# EAGLE schematic Main-DESKTOP-GF130J3 (EAGLE 9.4.2)

## Sheet 1 of 4: Filter EMI PMP20694
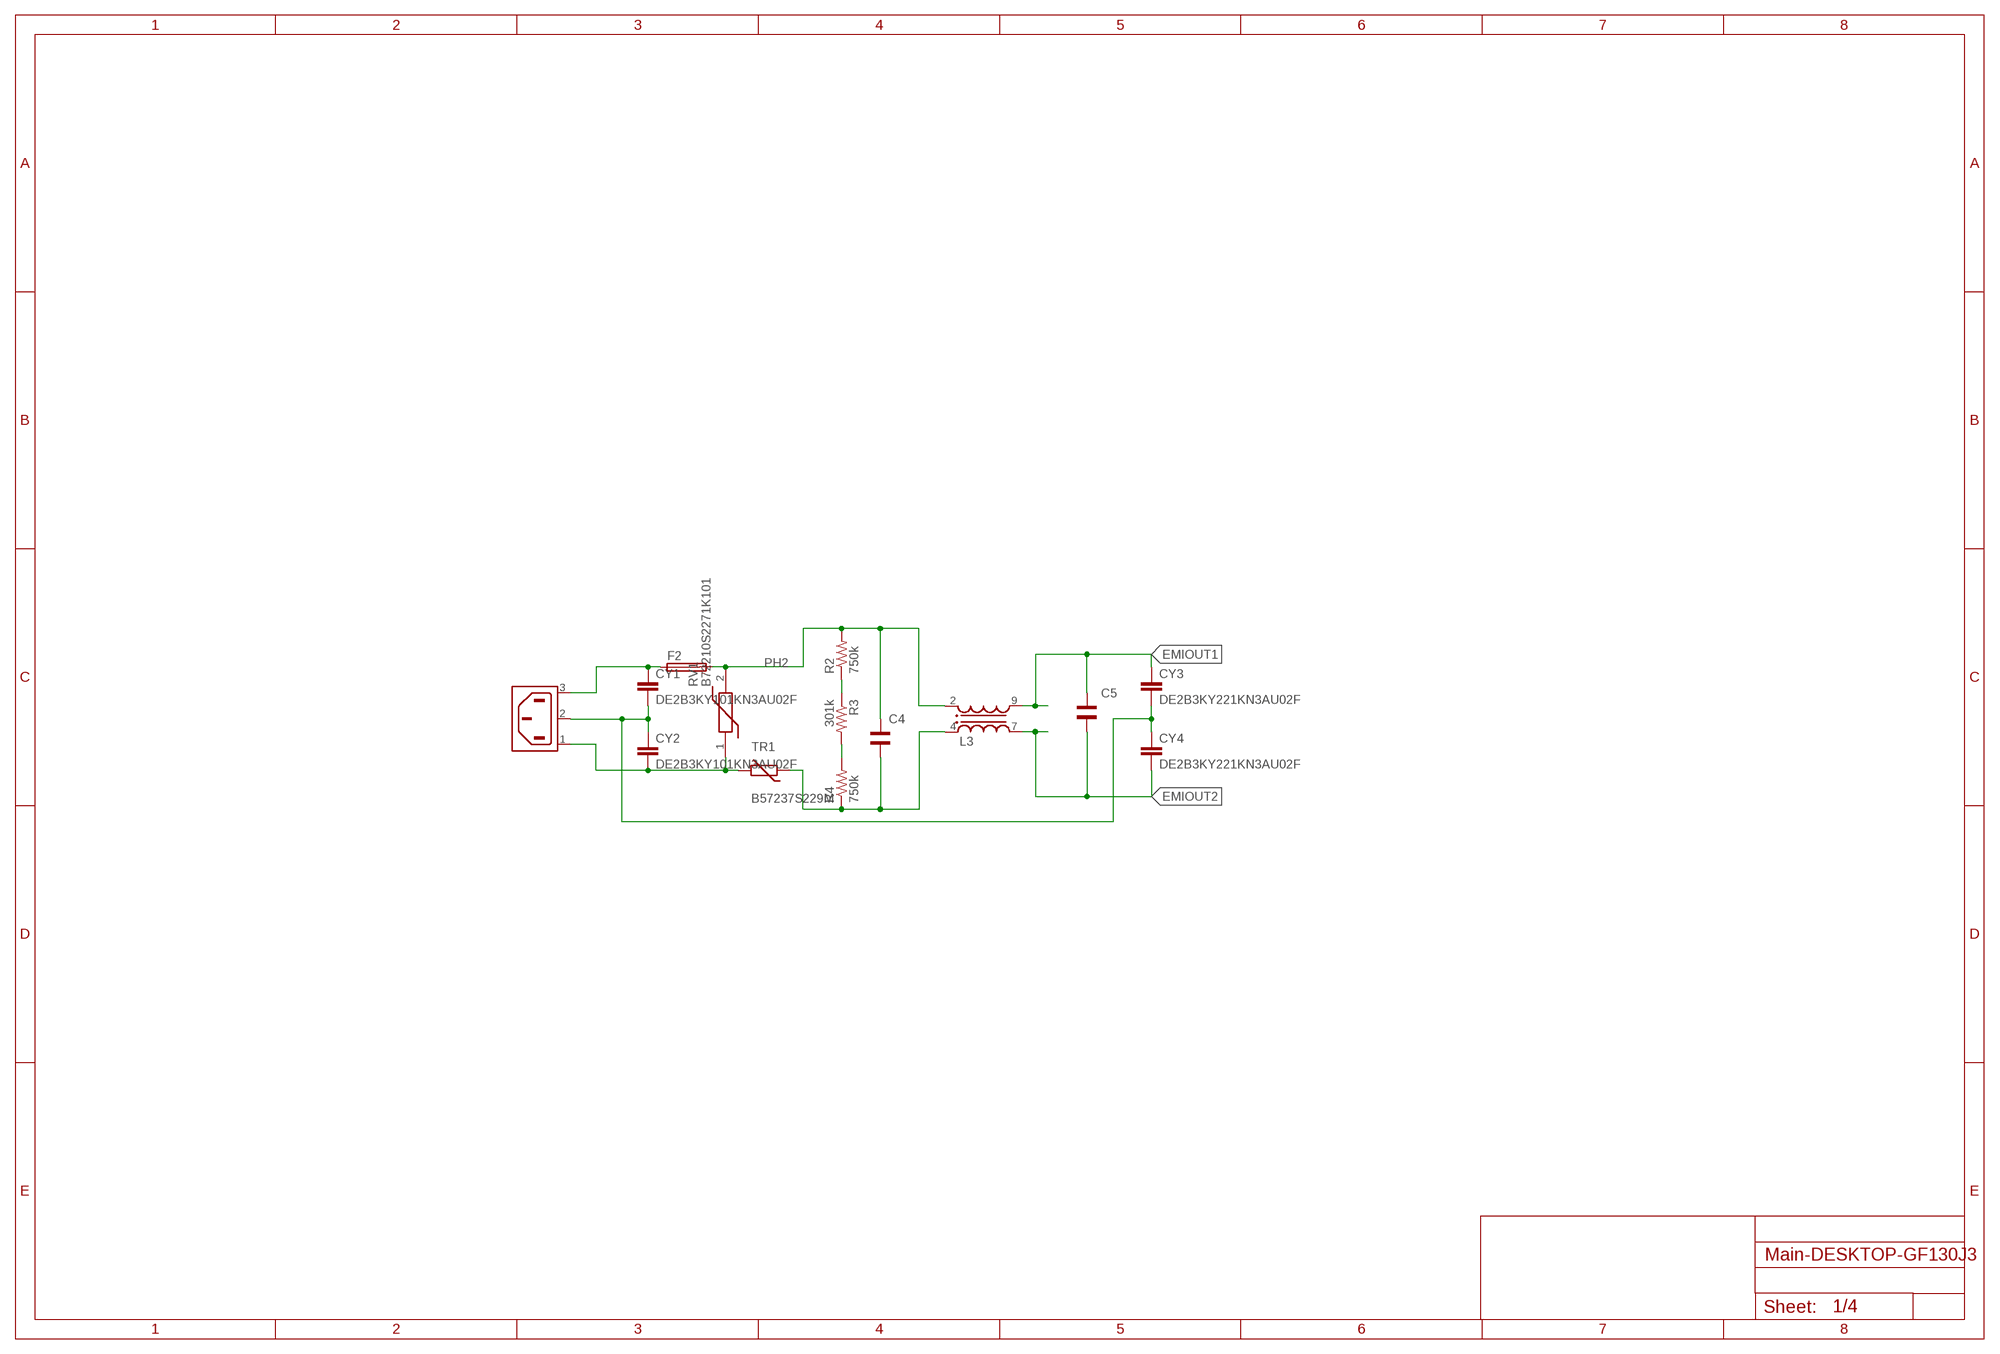
[diagram p0: schematic, sheet 1]

### Parts
C4  WCAP-FTXX_890334025039CS  [WCAP-FTXX_15X18X14X8]
C5  WCAP-FTXX_890334025039CS  [WCAP-FTXX_15X18X14X8]
CY1  DE2B3KY101KN3AU02F  CYYC7B5  [YC7B5]
CY2  DE2B3KY101KN3AU02F  CYYC7B5  [YC7B5]
CY3  DE2B3KY221KN3AU02F  CYYC7B5  [YC7B5]
CY4  DE2B3KY221KN3AU02F  CYYC7B5  [YC7B5]
F2  GSH15  [GSH15]
L3  WE-CMB_L_744824310  [WE-CMB_L]
R2  750k  R-US_R1206  [R1206]
R3  301k  R-US_R1206  [R1206]
R4  750k  R-US_R1206  [R1206]
RV1  B72210S2271K101  [B72210S2271K101]
TR1  B57237S229M  THERMISTOR_R-7,5  [R-7,5]
X1  6ESRM-P  [6ESRM-P]

### Nets
EMIOUT1: C5.2 CY3.1 L3.9 ; also sheet 2
EMIOUT2: C5.1 CY4.2 L3.7 ; also sheet 2
N$20: R2.1 R3.1
N$25: R3.2 R4.2
N$29: CY1.1 F2.1 X1.3(AC2)
N$38: CY2.2 RV1.1 TR1.2 X1.1(AC1)
N$40: C4.2 L3.4 R4.1 TR1.1
N$45: CY1.2 CY2.1 CY3.2 CY4.1 X1.2(SH)
PH2: C4.1 F2.2 L3.2 R2.2 RV1.2

## Sheet 2 of 4: PFC
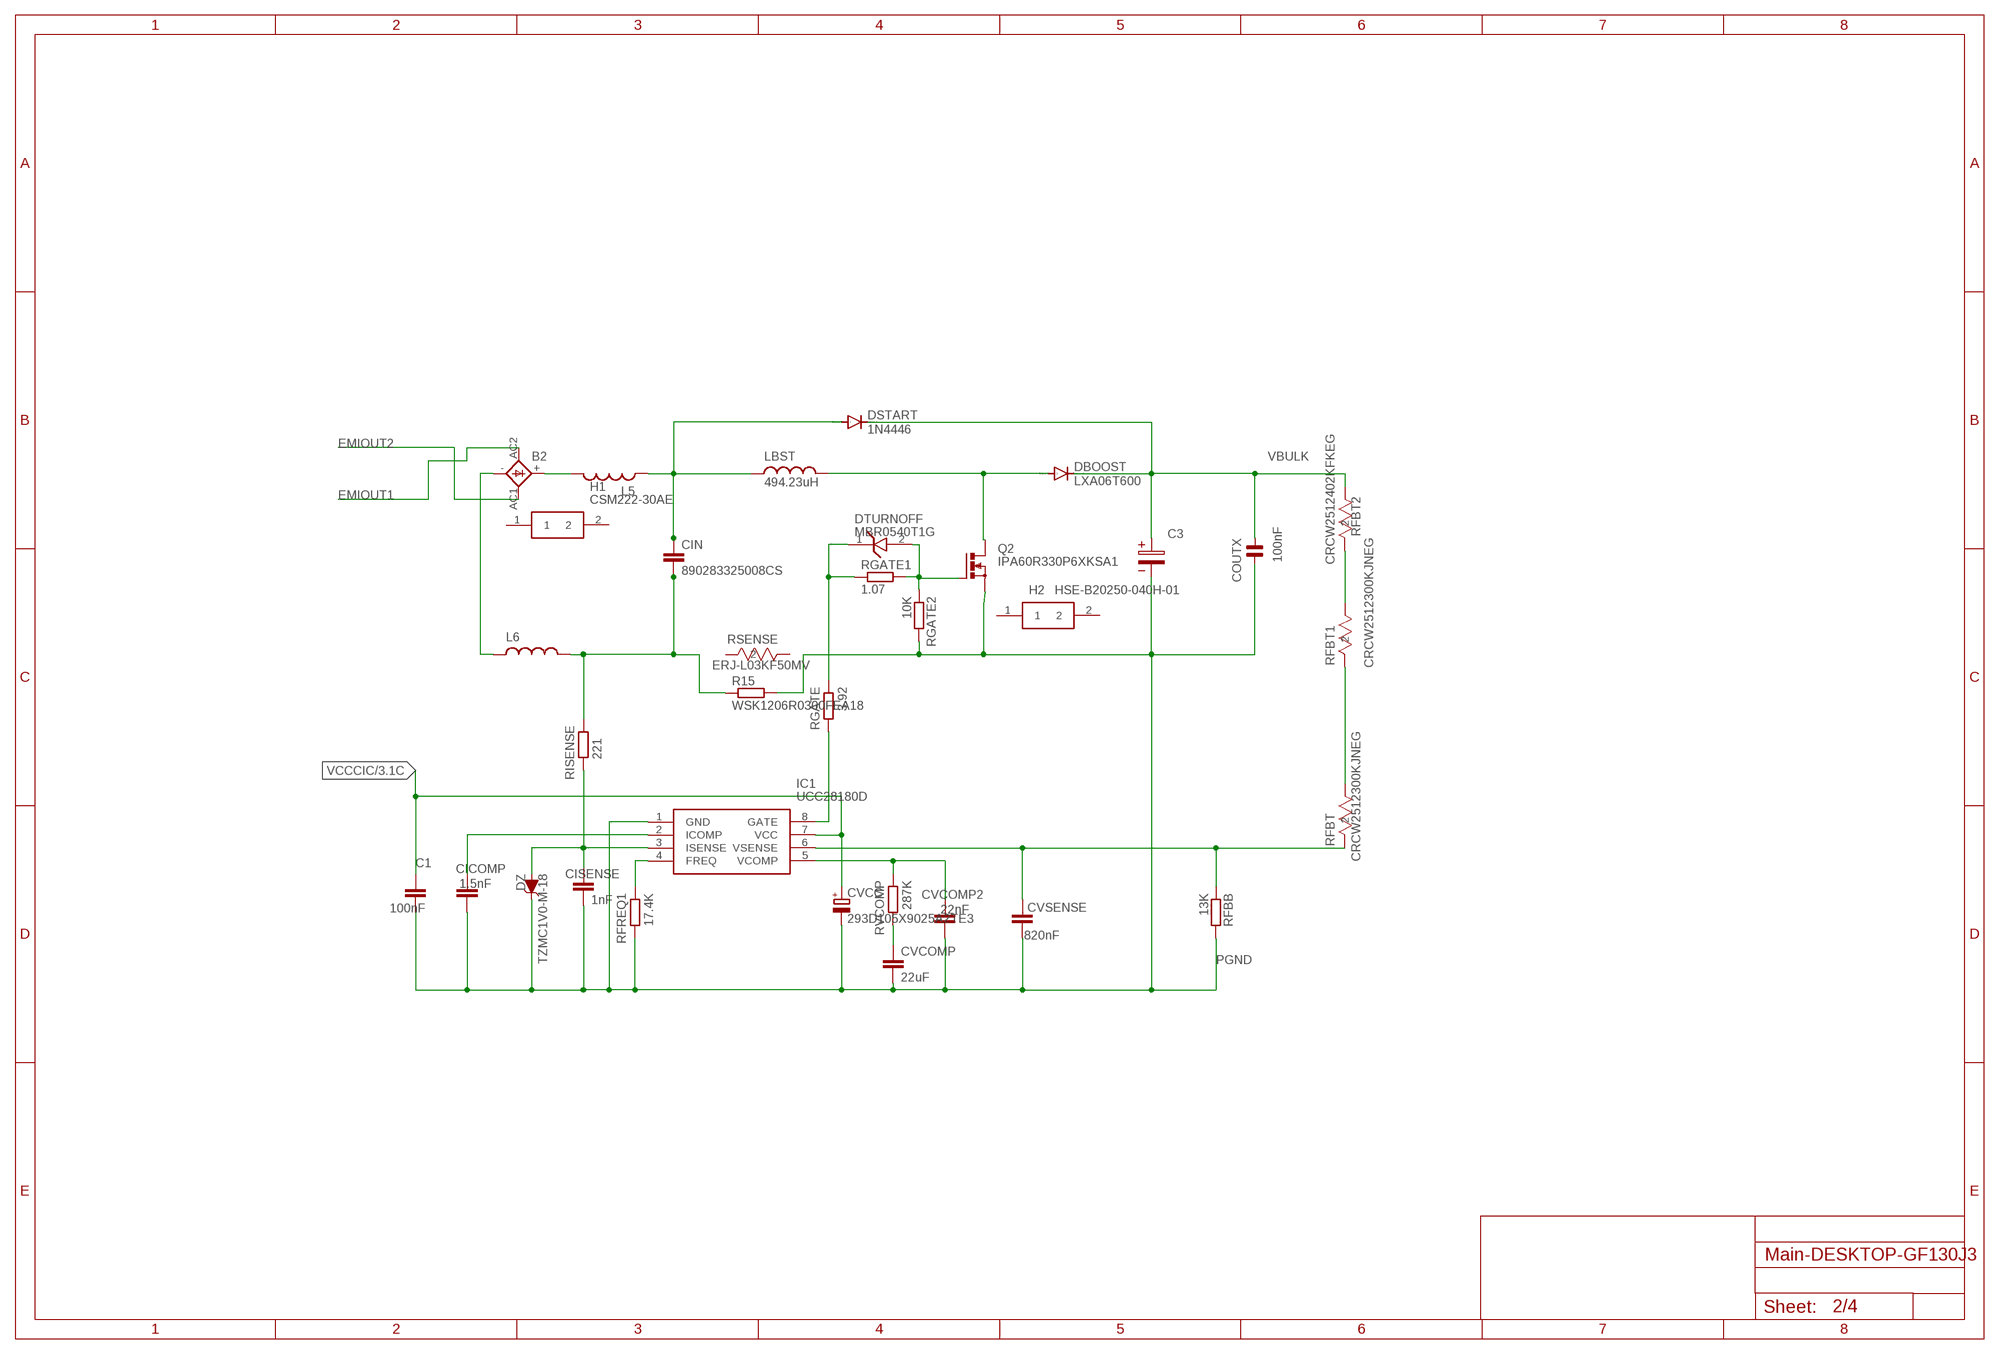
[diagram p1: schematic, sheet 2]

### Parts
B2  GBU4  [GBU4S]
C1  100nF  C-EUC0603  [C0603]
C3  WCAP-AIG8_30X46_861011485018  [30X10X2(DXPXΦ)]
CICOMP  1.5nF  C-EUC0603K  [C0603K]
CIN  890283325008CS  C-EU150-072X183  [C150-072X183]
CISENSE  1nF  C-EUC0402  [C0402]
COUTX  100nF  C-NP-10,0-14,0X6,0  [C10,0-14,0X6,0]
CVCC  293D105X9025A2TE3  CPOL-EUCT3216  [CT3216]
CVCOMP  22uF  C-EUC0805  [C0805]
CVCOMP2  22nF  C-EUC0603K  [C0603K]
CVSENSE  820nF  C-EUC0805  [C0805]
DBOOST  LXA06T600  DIODE-TO220V  [TO220ACS]
DSTART  1N4446  [DO35-10]
DTURNOFF  MBR0540T1G  [SOD3716X135N]
DZ  TZMC1V0-M-18  [DIOMELF3515]
H1  CSM222-30AE  [CSM22230AE]
H2  HSE-B20250-040H-01  [HSEB20250040H01]
IC1  UCC28180D  [SOIC127P600X175-8N]
L5  WE-FI_7447016  [WE-FI_7447016]
L6  WE-FI_7447016  [WE-FI_7447016]
LBST  494.23uH  WE-SI_744139  [WE-SI_744139]
Q2  IPA60R330P6XKSA1  PMOSFET_NTO220BV  [TO220BV]
R15  WSK1206R0300FEA18  R-EU_R3216  [R3216]
RFBB  13K  R-EU_R0603  [R0603]
RFBT  CRCW2512300KJNEG  [RC2512N]
RFBT1  CRCW2512300KJNEG  [RC2512N]
RFBT2  CRCW2512402KFKEG  [RC2512N]
RFREQ1  17.4K  R-EU_R0603  [R0603]
RGATE  3.92  R-EU_R0603  [R0603]
RGATE1  1.07  R-EU_R0603  [R0603]
RGATE2  10K  R-EU_R0603  [R0603]
RISENSE  221  R-EU_R0603  [R0603]
RSENSE  ERJ-L03KF50MV  [RC0603N]
RVCOMP  287K  R-EU_R0603  [R0603]

### Nets
EMIOUT1: B2.AC2(AC1) ; also sheet 1
EMIOUT2: B2.AC1(AC2) ; also sheet 1
GATE: IC1.8(GATE) RGATE.2
N$1: B2.- L6.1
N$2: CIN.2 L6.2 R15.1 RISENSE.1
N$3: DBOOST.A LBST.2 Q2.D
N$4: B2.+ L5.2
N$7: CIN.1 DSTART.A L5.1 LBST.1
N$10: DTURNOFF.2(A) Q2.G RGATE1.2 RGATE2.1
N$11: DTURNOFF.1(K) RGATE1.1 RGATE.1
N$16: CVCOMP.1 RVCOMP.2
N$28: RFBT1.1 RFBT2.2
N$31: RFBT1.2 RFBT.1
N$FREQ: IC1.4(FREQ) RFREQ1.1
N$ICOMP: CICOMP.2 IC1.2(ICOMP)
N$ISENSE: CISENSE.1 DZ.1(A) IC1.3(ISENSE) RISENSE.2
N$VCOMP: CVCOMP2.2 IC1.5(VCOMP) RVCOMP.1
N$VSENSE: CVSENSE.2 IC1.6(VSENSE) RFBB.1 RFBT.2
PGND: C1.2 C3.2 CICOMP.1 CISENSE.2 COUTX.2 CVCC.- CVCOMP2.1 CVCOMP.2 CVSENSE.1 DZ.2(C) IC1.1(GND) Q2.S R15.2 RFBB.2 RFREQ1.2 RGATE2.2 ; also sheet 3
VBULK: C3.1 COUTX.1 DBOOST.C DSTART.C RFBT2.1 ; also sheet 3
VCCCIC: C1.1 CVCC.+ IC1.7(VCC) ; also sheet 3
Unconnected: H1.1 H1.2 H2.1 H2.2 RSENSE.1 RSENSE.2

## Sheet 3 of 4: Flyback
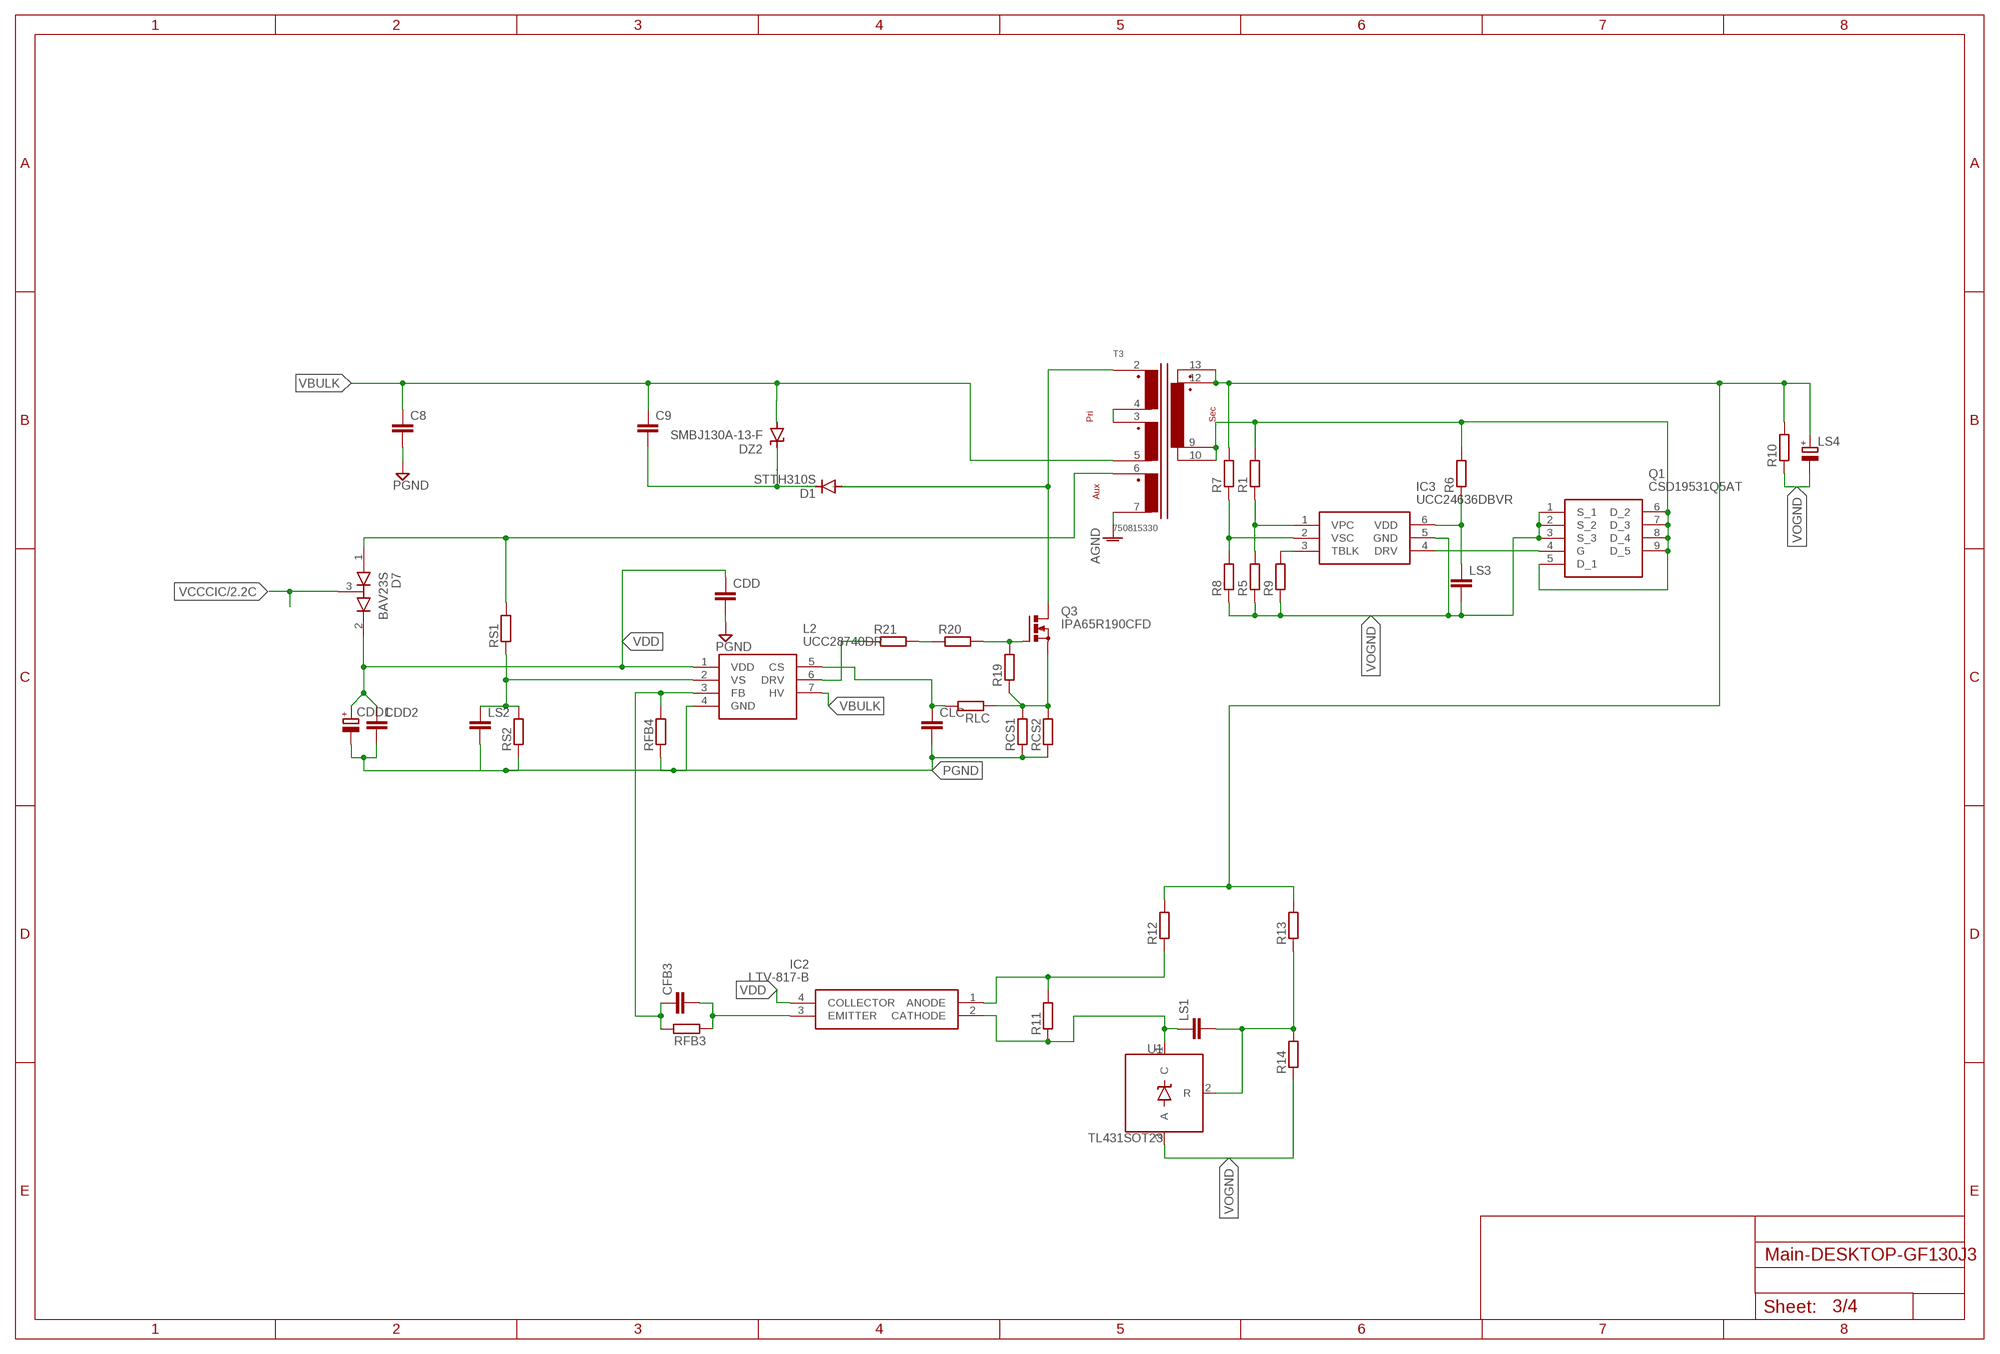
[diagram p2: schematic, sheet 3]

### Parts
C8  C-EUC0805  [C0805]
C9  C-EUC0805  [C0805]
CDD  C-EUC0805  [C0805]
CDD1  CPOL-EUTT2D5  [TT2D5]
CDD2  C-EUC0805  [C0805]
CFB3  C-EUC0805  [C0805]
CLC  C-EUC0805  [C0805]
D1  STTH310S  DIODE-SMC  [SMC]
D7  BAV23S  [SOT95P230X110-3N]
DZ2  SMBJ130A-13-F  SUPPRESSOR-SMBJ  [SMBJ]
IC2  LTV-817-B  [DIP762W60P254L460H420Q4N]
IC3  UCC24636DBVR  [SOT95P280X145-6N]
L2  UCC28740DR  [D(R-PDSO-G7)]
LS1  C-EUC0805  [C0805]
LS2  C-EUC0805  [C0805]
LS3  C-EUC0805  [C0805]
LS4  CPOL-EU153CLV-1010  [153CLV-1010]
Q1  CSD19531Q5AT  [CSD19531Q5AT]
Q3  IPA65R190CFD  PMOSFET_NTO220BV  [TO220BV]
R1  R-EU_R0805  [R0805]
R5  R-EU_R0805  [R0805]
R6  R-EU_R0805  [R0805]
R7  R-EU_R0805  [R0805]
R8  R-EU_R0805  [R0805]
R9  R-EU_R0805  [R0805]
R10  R-EU_R0805  [R0805]
R11  R-EU_R0805  [R0805]
R12  R-EU_R0805  [R0805]
R13  R-EU_R0805  [R0805]
R14  R-EU_R0805  [R0805]
R19  R-EU_R0805  [R0805]
R20  R-EU_R0805  [R0805]
R21  R-EU_R0805  [R0805]
RCS1  R-EU_R0805  [R0805]
RCS2  R-EU_R0805  [R0805]
RFB3  R-EU_R0805  [R0805]
RFB4  R-EU_R0805  [R0805]
RLC  R-EU_R0805  [R0805]
RS1  R-EU_R0805  [R0805]
RS2  R-EU_R0805  [R0805]
T3  750815330  [EE25/13/7_THT_H_14PIN_(5644)]
U1  TL431SOT23  [SOT23-3]

### Nets
N$5: LS1.2 R13.1 R14.2 U1.2(R)
N$6: CFB3.2 IC2.3(EMITTER) RFB3.1
N$8: T3.3 T3.4
N$12: D7.1 RS1.2 T3.6
N$15: IC2.1(ANODE) R11.2 R12.1
N$17: CFB3.1 L2.3(FB) RFB3.2 RFB4.2
N$18: IC2.2(CATHODE) LS1.1 R11.1 U1.1(C)
N$19: LS4.+ R7.2 R10.2 R12.2 R13.2 T3.12 T3.13
N$21: IC3.2(VSC) R7.1 R8.2
N$22: IC3.4(DRV) Q1.4(G)
N$23: IC3.1(VPC) R1.1 R5.2
N$24: IC3.3(TBLK) R9.2
N$26: IC3.6(VDD) LS3.1 R6.1
N$27: L2.2(VS) LS2.1 RS1.1 RS2.2
N$30: Q1.5(D_1) Q1.6(D_2) Q1.7(D_3) Q1.8(D_4) Q1.9(D_5) R1.2 R6.2 T3.9 T3.10
N$43: R20.1 R21.2
N$44: Q3.G R19.2 R20.2
N$50: C9.2 D1.C DZ2.C
N$52: D1.A Q3.D T3.2
N$CS: CLC.1 L2.5(CS) RLC.2
N$DRV: L2.6(DRV) R21.1
PGND: C8.2 CDD1.- CDD2.2 CDD.2 CLC.2 L2.4(GND) LS2.2 RCS1.1 RCS2.1 RFB4.1 RS2.1 T3.7 ; supply symbol labelled AGND ; also sheet 2
TOISENSE: Q3.S R19.1 RCS1.2 RCS2.2 RLC.1
VBULK: C8.1 C9.1 DZ2.A L2.7(HV) T3.5 ; also sheet 2
VCCCIC: D7.3 ; also sheet 2
VDD: CDD1.+ CDD2.1 CDD.1 D7.2 IC2.4(COLLECTOR) L2.1(VDD)
VOGND: IC3.5(GND) LS3.2 LS4.- Q1.1(S_1) Q1.2(S_2) Q1.3(S_3) R5.1 R8.1 R9.1 R10.1 R14.1 U1.3(A)

## Sheet 4 of 4: Forward
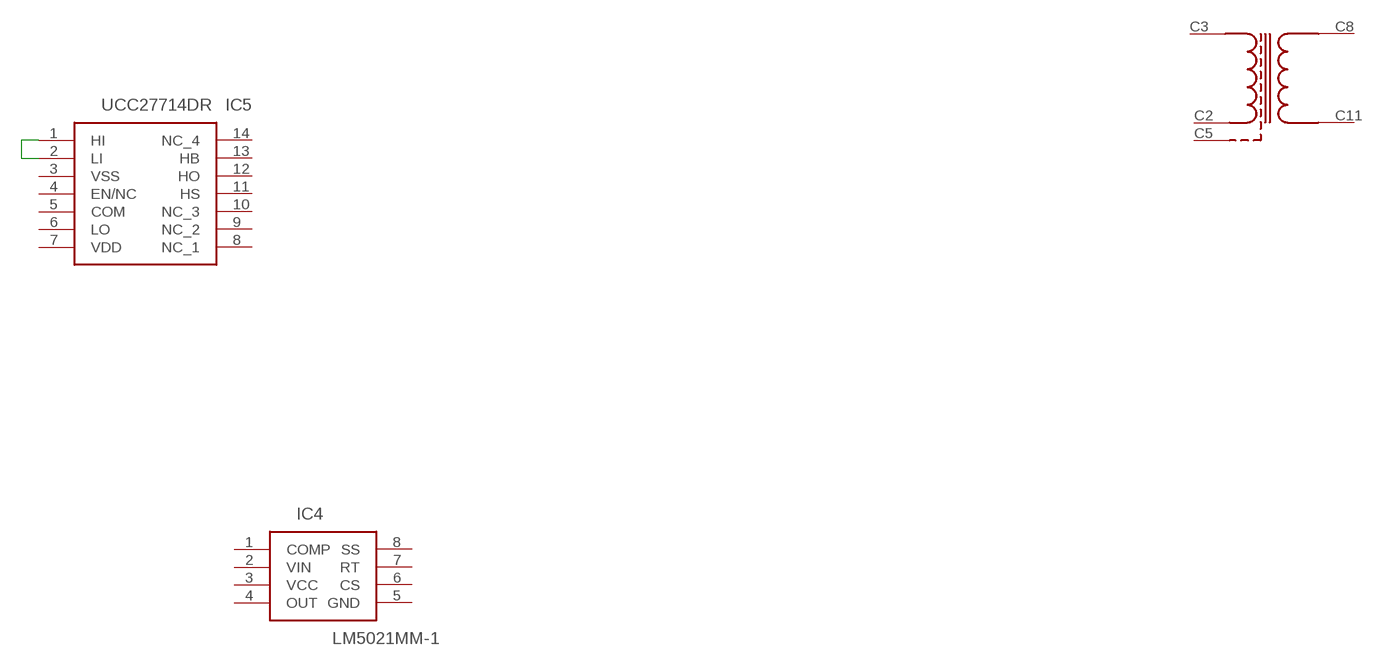
[diagram p3: schematic, sheet 4]

### Parts
IC4  LM5021MM-1  [SOP65P490X110-8N]
IC5  UCC27714DR  [SOIC127P600X175-14N]
T2  750315800  [PQ3230]

### Nets
N$9: IC5.1(HI) IC5.2(LI)
Unconnected: IC4.1(COMP) IC4.2(VIN) IC4.4(OUT) IC4.6(CS) IC4.7(RT) IC4.8(SS) IC5.4(EN/NC) IC5.5(COM) IC5.6(LO) IC5.8(NC_1) IC5.9(NC_2) IC5.10(NC_3) IC5.11(HS) IC5.12(HO) IC5.13(HB) IC5.14(NC_4) T2.C2 T2.C3 T2.C5 T2.C8 T2.C11

## Power pins joined to a net without a drawn wire
GND: IC4.5(GND)
VCC: IC4.3(VCC)
VDD: IC5.7(VDD)
VSS: IC5.3(VSS)

## Library data of the parts
B2 = rectifier:GBU4: GENERAL INSTRUMENT RECTIFIER
C1 C8 C9 CDD CDD2 CFB3 CICOMP CIN CISENSE CLC CVCOMP CVCOMP2 CVSENSE LS1-LS3 = rcl:C-EU: CAPACITOR, European symbol; SPICEPREFIX: C
C3 = Wurth_Elektronik_Passive_Capacitors_rev18b:WCAP-AIG8: WCAP-AIG8 Aluminum Electrolytic Capacitors Characteristics Aluminum Electrolytic Capacitor Recommended soldering: Wave Operating temperature: -25 °C to +85 °C General purpose product series Load life:2000 h @ +85 °C Package name and Variant abbreviation: Package: D X P X Φ = Diameter of the outline X Pitch of the hole X Diameter of the hole. <http://katalog.we-online.de/media/images/eisos/WCAP-AIG8_pf2.jpg> Details see: http://katalog.we-online.de/en/pbs/WCAP-AIG8?m Updated by: Yingchun,Shan Updated: 2017-03-16 2017 (C) Wurth Elektronik; WE-NUMBER: 861011485018/330uF
C4 C5 = Wurth_Elektronik_Passive_Capacitors_rev18b:WCAP-FTXX: WCAP-FTXX Film Capacitors Characteristics MKP,Metallized Polypropylene Film Recommended soldering :Wave Operating temperature:-40 °C to +105 °C Climate category: 40/105/56/B Self-healing properties Certificates: cULus, CQC, VDE Applications Safety applications Filter Power supplies Electrical property <http://katalog.we-online.de/media/images/eisos/WCAP-FTXX_pf2.jpg> Details see: http://katalog.we-online.de/pbs/datasheet/890334022007.pdf Created: 2014-09-15 2014 (C) Wurth Elektronik; WE-NUMBER: 890334025039CS/0,47uF
CDD1 CVCC LS4 = rcl:CPOL-EU: POLARIZED CAPACITOR, European symbol; SPICEPREFIX: C
COUTX = cap-pan40:C-NP: NON-POLARIZED FILM/CHIP
CY1-CY4 = rcl:CY: Y CAPACITOR for power line; SPICEPREFIX: C
D1 DBOOST = diode:DIODE-: DIODE
D7 = SamacSys_Parts:BAV23S: BAV23S, Rectifier Diode, Switching 0.225A max, 250V Dual, 3-Pin, TO-236AB Source: Datasheet <http://www.nxp.com/documents/data_sheet/BAV23_SER.pdf>; DESCRIPTION: BAV23S, Rectifier Diode, Switching 0.225A max, 250V Dual, 3-Pin, TO-236AB; HEIGHT: 1.1mm; MANUFACTURER_NAME: Nexperia; MANUFACTURER_PART_NUMBER: BAV23S; MOUSER_PART_NUMBER: N/A; MOUSER_PRICE-STOCK: https://www.mouser.com/Search/Refine.aspx?Keyword=N%2FA
DSTART = diode:1N4446: DIODE high speed (Philips)
DTURNOFF = SamacSys_Parts:MBR0540T1G: 0.5A 40V Schottky Rectifier, MBR0540T1G ON Semiconductor MBR0540T1G Schottky Diode, 0.5A, 40V, 2-Pin SOD-123 Source: Datasheet <http://www.onsemi.com/pub/Collateral/MBR0540T1-D.PDF>; ALLIED_NUMBER: 70099497; ALLIED_PRICE-STOCK: http://www.alliedelec.com/on-semiconductor-mbr0540t1g/70099497/; DESCRIPTION: 0.5A 40V Schottky Rectifier, MBR0540T1G ON Semiconductor MBR0540T1G Schottky Diode, 0.5A, 40V, 2-Pin SOD-123; HEIGHT: 1.35mm; MANUFACTURER_NAME: ON Semiconductor; MANUFACTURER_PART_NUMBER: MBR0540T1G; MOUSER_PART_NUMBER: 863-MBR0540T1G; MOUSER_PRICE-STOCK: https://www.mouser.com/Search/Refine.aspx?Keyword=863-MBR0540T1G; RS_PART_NUMBER: 0463842P; RS_PRICE-STOCK: http://uk.rs-online.com/web/p/products/0463842P
DZ = TZMC1V0-M-18:TZMC1V0-M-18
DZ2 = diode:SUPPRESSOR-: Suppressor diode
F2 = fuse:GSH15: FUSE HOLDER grid 15mm, 19649 Wickmann; MPN: 64900001039; OC_FARNELL: 1271673; OC_NEWARK: 02P0318
H1 = SamacSys_Parts:CSM222-30AE: OHMITE - CSM222-30AE - HEAT SINK, ALUMINIUM ALLOY, 30MM, TO-220 Source: Datasheet <https://www.ohmite.com/assets/docs/sink_csm.pdf?r=false>; ALLIED_NUMBER: 70952223; ALLIED_PRICE-STOCK: https://www.alliedelec.com/ohmite-csm222-30ae/70952223/; DESCRIPTION: OHMITE - CSM222-30AE - HEAT SINK, ALUMINIUM ALLOY, 30MM, TO-220; HEIGHT: 31mm; MANUFACTURER_NAME: Ohmite; MANUFACTURER_PART_NUMBER: CSM222-30AE; MOUSER_PART_NUMBER: 588-CSM222-30AE; MOUSER_PRICE-STOCK: https://www.mouser.com/Search/Refine.aspx?Keyword=588-CSM222-30AE
H2 = SamacSys_Parts:HSE-B20250-040H-01: Heat Sinks 25x29x12.5mm w/pin extrusion TO-220 Source: Datasheet <https://componentsearchengine.com/Datasheets/1/HSE-B20250-040H-01.pdf>; DESCRIPTION: Heat Sinks 25x29x12.5mm w/pin extrusion TO-220; HEIGHT: 25mm; MANUFACTURER_NAME: CUI; MANUFACTURER_PART_NUMBER: HSE-B20250-040H-01; MOUSER_PART_NUMBER: 490-HSE-B20250040H01; MOUSER_PRICE-STOCK: https://www.mouser.com/Search/Refine.aspx?Keyword=490-HSE-B20250040H01
IC1 = SamacSys_Parts:UCC28180D: TEXAS INSTRUMENTS - UCC28180D - IC, BOOST PFC CONT, GATE DRIVE, SOIC-8 Source: Datasheet <http://www.ti.com/lit/gpn/ucc28180>; DESCRIPTION: TEXAS INSTRUMENTS - UCC28180D - IC, BOOST PFC CONT, GATE DRIVE, SOIC-8; HEIGHT: 1.75mm; MANUFACTURER_NAME: Texas Instruments; MANUFACTURER_PART_NUMBER: UCC28180D; MOUSER_PART_NUMBER: 595-UCC28180D; MOUSER_PRICE-STOCK: https://www.mouser.com/Search/Refine.aspx?Keyword=595-UCC28180D
IC2 = SamacSys_Parts:LTV-817-B: Lite-On LTV-817-B DC Input Transistor Output Optocoupler, Through Hole, 4-Pin PDIP Source: Datasheet <http://optoelectronics.liteon.com/upload/download/DS-70-96-0016/LTV-8X7 series 201610 .pdf>; DESCRIPTION: Lite-On LTV-817-B DC Input Transistor Output Optocoupler, Through Hole, 4-Pin PDIP; HEIGHT: 4.2mm; MANUFACTURER_NAME: Lite-On; MANUFACTURER_PART_NUMBER: LTV-817-B; MOUSER_PART_NUMBER: N/A; MOUSER_PRICE-STOCK: https://www.mouser.com/Search/Refine.aspx?Keyword=N%2FA; RS_PART_NUMBER: 6912145P; RS_PRICE-STOCK: http://uk.rs-online.com/web/p/products/6912145P
IC3 = SamacSys_Parts:UCC24636DBVR: Synchronous Rectifier Controller With Ultra-Low Standby Current Source: Datasheet <http://www.ti.com/lit/gpn/ucc24636>; DESCRIPTION: Synchronous Rectifier Controller With Ultra-Low Standby Current; HEIGHT: 1.45mm; MANUFACTURER_NAME: Texas Instruments; MANUFACTURER_PART_NUMBER: UCC24636DBVR; MOUSER_PART_NUMBER: 595-UCC24636DBVR; MOUSER_PRICE-STOCK: https://www.mouser.com/Search/Refine.aspx?Keyword=595-UCC24636DBVR
IC4 = SamacSys_Parts:LM5021MM-1: AC-DC I-Mode PWM Controller,LM5021MM-1 Source: Datasheet <http://www.ti.com/lit/ds/symlink/lm5021.pdf>; DESCRIPTION: AC-DC I-Mode PWM Controller,LM5021MM-1; HEIGHT: 1.1mm; MANUFACTURER_NAME: Texas Instruments; MANUFACTURER_PART_NUMBER: LM5021MM-1
IC5 = SamacSys_Parts:UCC27714DR: Gate Drivers High-Speed, 4-A, 600-V High-Side Low-Side Gate Driver 14-SOIC -40 to 125 Source: Datasheet <http://www.ti.com/lit/ds/symlink/ucc27714.pdf>; DESCRIPTION: Gate Drivers High-Speed, 4-A, 600-V High-Side Low-Side Gate Driver 14-SOIC -40 to 125; HEIGHT: 1.75mm; MANUFACTURER_NAME: Texas Instruments; MANUFACTURER_PART_NUMBER: UCC27714DR; MOUSER_PART_NUMBER: 595-UCC27714DR; MOUSER_PRICE-STOCK: https://www.mouser.com/Search/Refine.aspx?Keyword=595-UCC27714DR
L2 = SamacSys_Parts:UCC28740DR: Constant-Voltage, Constant-Current Flyback Controller Using Opto-Coupler Feedback Source: Datasheet <http://www.ti.com/lit/gpn/ucc28740>; DESCRIPTION: Constant-Voltage, Constant-Current Flyback Controller Using Opto-Coupler Feedback; HEIGHT: mm; MANUFACTURER_NAME: Texas Instruments; MANUFACTURER_PART_NUMBER: UCC28740DR; MOUSER_PART_NUMBER: 595-UCC28740DR; MOUSER_PRICE-STOCK: https://www.mouser.com/Search/Refine.aspx?Keyword=595-UCC28740DR
L3 = Wurth_Elektronik_Passive_rev18f:WE-CMB: WE-CMB Common Mode Power Line Choke Characteristics With this product you can achieve high suppression of asymmetric interferences even at low frequency ranges Broadband filtering because of low capacitance winding technique Very compact design Highest possible current with small sizes High interference compression asymmetric interference rates also at low frequence range Custom designs on request Operating temperature: –40 ºC to +125 ºC Applications Power electronics Power line input and output filter For filtering of devices without a stable ground connection Radio interference suppression in motors Suppression of common mode noise <http://katalog.we-online.de/media/images/v2/Family_WE-CMB_XS-XXL.jpg> Details see: http://katalog.we-online.de/en/pbs/WE-CMB? Updated by Dan Xu 2014-06-30 2014 (C) Wurth Elektronik; WE-NUMBER: 744824310/10mH
L5 L6 = Wurth_Elektronik_Passive_rev18f:WE-FI: WE-FI Leaded Toroidal Line Choke Characteristics Current loading up to 5 A Iron powder cores with low losses Low magnetically leakage field Operating temperature: -25 C to +125 C Custom designs on reques Applications Application in voltage transformers and power supplies For interference frequencies up to 10 MHz; for switching frequencies up to 100 kHz Perfect for filtering of symmetric interferences <http://katalog.we-online.de/media/images/v2/Family_WE-FI.jpg> Details see: http://katalog.we-online.de/en/pbs/WE-FI?m Updated on 2015-06-16 2015 (C) Wurth Elektronik
LBST = Wurth_Elektronik_Passive_rev18f:WE-SI: Leaded Toroidal Storage Choke Characteristics Low magnetic stray field Low leakage and minimal noise because of the toroidal core made of iron powder Available for rated currents 0.5 A, 1 A, 3 A and 5 A Custom designs on request Applications Perfectly suitable for switching regulators from – Texas Instruments (LM) – Linear Technology (LT) – Maxim Used for example in switching power supplies and voltage transformers Switching regulators up to 100 kHz <http://katalog.we-online.de/media/images/v2/Family_WE-SI.jpg> Details see: http://katalog.we-online.de/en/pbs/WE-SI/744101 Updated by Dan Xu 2014-06-10 2014 (C) Wurth Elektronik; WE-NUMBER: 744139/1124uH
Q1 = SamacSys_Parts:CSD19531Q5AT: Texas Instruments CSD19531Q5AT N-channel MOSFET Transistor, 110 A, 100 V, 8-Pin VSON Source: Datasheet <http://www.ti.com/general/docs/lit/getliterature.tsp?genericPartNumber=CSD19531Q5A&&fileType=pdf>; DESCRIPTION: Texas Instruments CSD19531Q5AT N-channel MOSFET Transistor, 110 A, 100 V, 8-Pin VSON; HEIGHT: 1mm; MANUFACTURER_NAME: Texas Instruments; MANUFACTURER_PART_NUMBER: CSD19531Q5AT; MOUSER_PART_NUMBER: 595-CSD19531Q5AT; MOUSER_PRICE-STOCK: https://www.mouser.com/Search/Refine.aspx?Keyword=595-CSD19531Q5AT; RS_PART_NUMBER: 8239259P; RS_PRICE-STOCK: http://uk.rs-online.com/web/p/products/8239259P
Q2 Q3 = transistor-power:PMOSFET_N: Power MOSFET N-Channel
R1 R5-R15 R19-R21 RCS1 RCS2 RFB3 RFB4 RFBB RFREQ1 RGATE RGATE1 RGATE2 RISENSE RLC RS1 RS2 RVCOMP = rcl:R-EU_: RESISTOR, European symbol; SPICEPREFIX: R
R2-R4 = rcl:R-US_: RESISTOR, American symbol; SPICEPREFIX: R
RFBT RFBT1 = CRCW2512300KJNEG:CRCW2512300KJNEG; MANUFACTURER_PART_NUMBER: CRCW2512300KJNEG; VENDOR: Vishay
RFBT2 = CRCW2512402KFKEG:CRCW2512402KFKEG; MANUFACTURER_PART_NUMBER: CRCW2512402KFKEG; VENDOR: Vishay
RSENSE = ERJ-L03KF50MV:ERJ-L03KF50MV; MANUFACTURER_PART_NUMBER: ERJL03KF50MV; VENDOR: Panasonic
RV1 = SamacSys_Parts:B72210S2271K101: EPCOS - B72210S2271K101 - VARISTOR, MOV, 710V, DISC 10MM Source: Datasheet <https://componentsearchengine.com/Datasheets/1/B72210S2271K101.pdf>; DESCRIPTION: EPCOS - B72210S2271K101 - VARISTOR, MOV, 710V, DISC 10MM; HEIGHT: 15mm; MANUFACTURER_NAME: EPCOS; MANUFACTURER_PART_NUMBER: B72210S2271K101; MOUSER_PART_NUMBER: 871-B72210S2271K101; MOUSER_PRICE-STOCK: https://www.mouser.com/Search/Refine.aspx?Keyword=871-B72210S2271K101
T2 = SamacSys_Parts:750315800
T3 = wurth_electronics_midcom_inc_v2-1:750815330: Package Style: EE25/13/7 Mounting: THT Pins: 14 pins Bobbin: 070-5644 Best pinouts for production vary per application. Please contact Wurth Electronics Midcom, Inc. for assistance with your custom design. Website: Wurth Electronics Midcom <http://www.we-online.com/midcom> Contact us Wurth Electronics Midcom, Inc. 121 Airport Dr. Watertown, SD 57201 Phone: (605) 886-4385 Fax: (605) 886-4486 E-Mail: midcom@we-online.com
TR1 = discrete:THERMISTOR_: Thermo Resistor
U1 = SparkFun-DiscreteSemi:TL431: TL431- Voltage Reference Precision Programmable Shunt Regulator Diode Datasheet <https://cdn.sparkfun.com/datasheets/Components/General%20IC/TL431-D.pdf> SparkFun Products: TL431-Voltage Reference PTH <https://www.sparkfun.com/products/11078> SparkFun Uh-Oh Battery Level Indicator <https://www.sparkfun.com/products/11087>
X1 = con-tycoelectronics:6ESRM-P: AC Connector 120/250 VAC Source: http://catalog.tycoelectronics.com .. ENG_DS_1654001_1099_SR_0406.pdf; MF: TYCO ELECTRONICS; MPN: 6ESRM-P; OC_FARNELL: unknown; OC_NEWARK: 87F1821